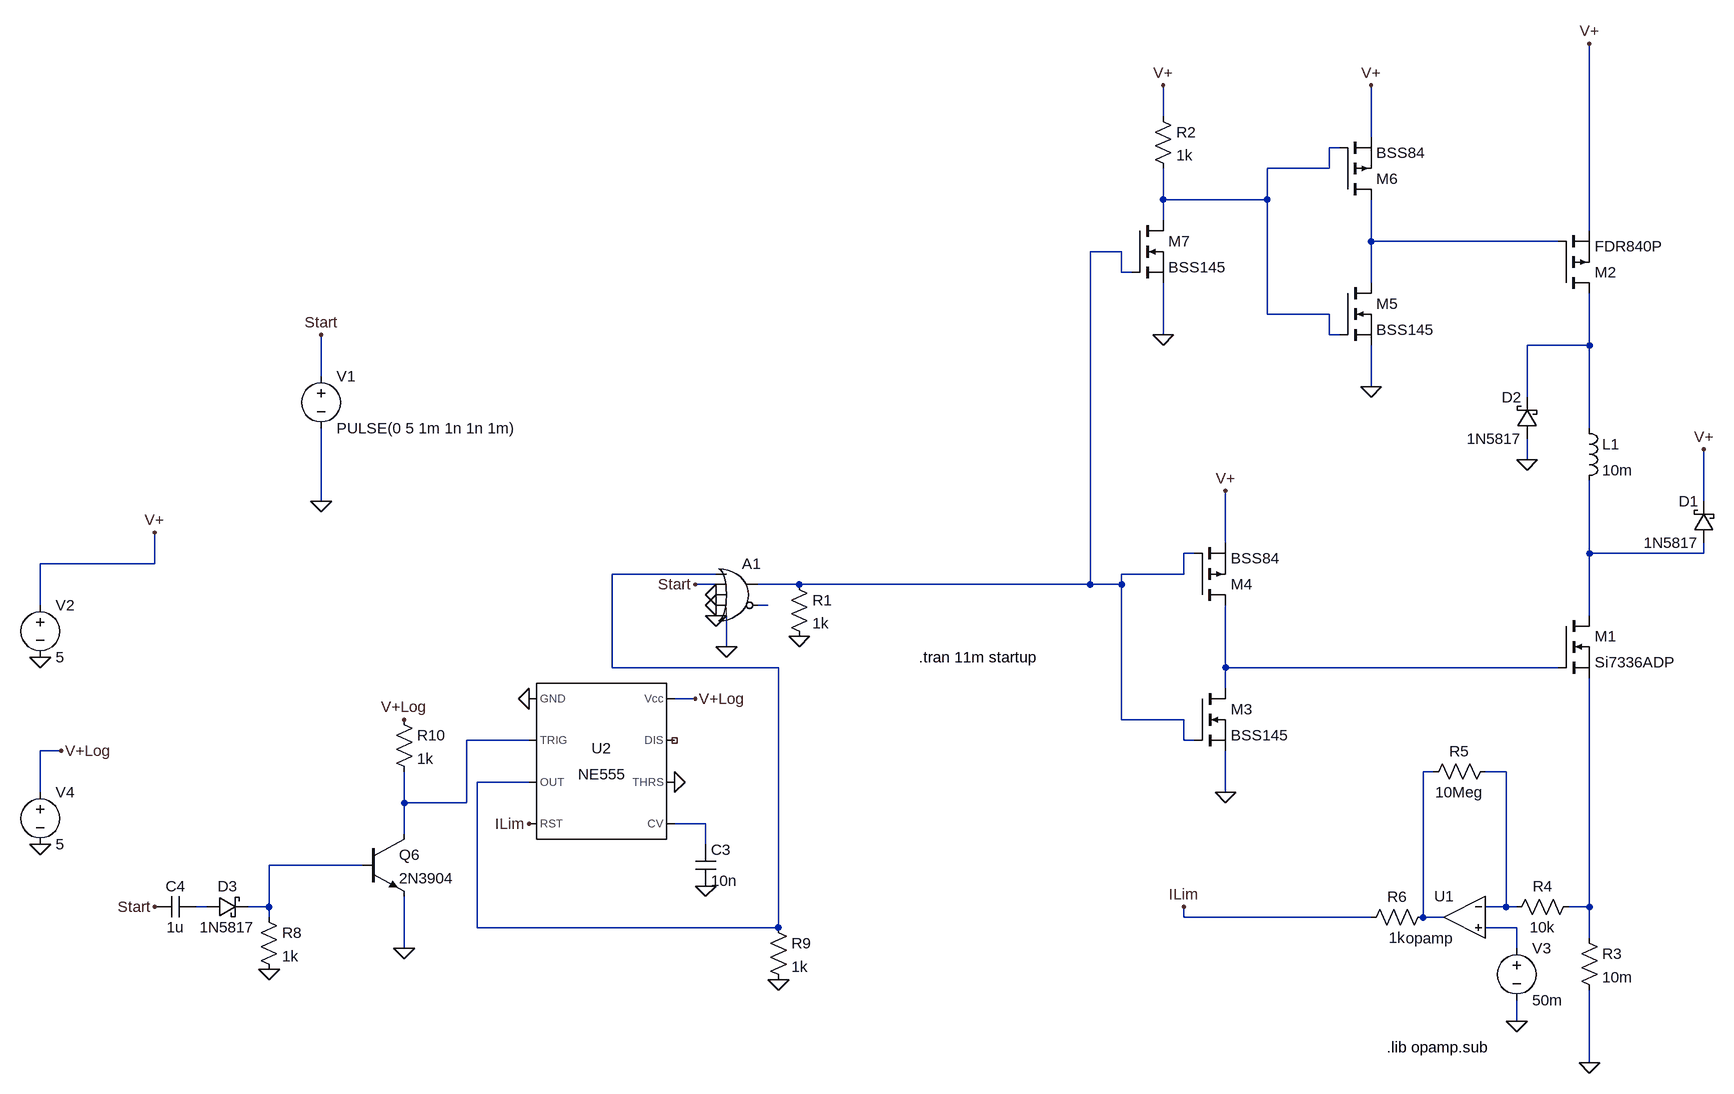
[diagram p0: schematic Saturation_Tester.asc]
Saturation_Tester.asc, the LTspice schematic file:
Version 4
SHEET 1 1768 1012
WIRE 752 -608 752 -656
WIRE 1072 -576 1072 -656
WIRE 1024 -560 1008 -560
WIRE 1008 -528 1008 -560
WIRE 1008 -528 912 -528
WIRE 752 -480 752 -528
WIRE 912 -480 912 -528
WIRE 912 -480 752 -480
WIRE 752 -448 752 -480
WIRE 1408 -432 1408 -720
WIRE 1072 -416 1072 -480
WIRE 1360 -416 1072 -416
WIRE 688 -400 640 -400
WIRE 688 -368 688 -400
WIRE 704 -368 688 -368
WIRE 1072 -352 1072 -416
WIRE 912 -304 912 -480
WIRE 1008 -304 912 -304
WIRE 752 -272 752 -352
WIRE 1008 -272 1008 -304
WIRE 1024 -272 1008 -272
WIRE 1408 -256 1408 -336
WIRE 1408 -256 1312 -256
WIRE -544 -208 -544 -272
WIRE 1072 -192 1072 -256
WIRE 1312 -176 1312 -256
WIRE 1408 -128 1408 -256
WIRE 1312 -80 1312 -112
WIRE -544 -16 -544 -128
WIRE 1584 -16 1584 -96
WIRE 848 48 848 -32
WIRE 800 64 784 64
WIRE 1408 64 1408 -48
WIRE 1584 64 1584 48
WIRE 1584 64 1408 64
WIRE -800 80 -800 32
WIRE -800 80 -976 80
WIRE 64 96 -96 96
WIRE 784 96 784 64
WIRE 784 96 688 96
WIRE 64 112 32 112
WIRE 192 112 128 112
WIRE 640 112 640 -400
WIRE 640 112 192 112
WIRE 688 112 688 96
WIRE 688 112 640 112
WIRE -976 144 -976 80
WIRE 144 144 128 144
WIRE 1408 160 1408 64
WIRE 80 208 80 160
WIRE -96 240 -96 96
WIRE 160 240 -96 240
WIRE 848 240 848 144
WIRE 1360 240 848 240
WIRE 848 272 848 240
WIRE 32 288 0 288
WIRE 688 320 688 112
WIRE 784 320 688 320
WIRE -224 352 -320 352
WIRE 784 352 784 320
WIRE 800 352 784 352
WIRE -944 368 -976 368
WIRE 1168 400 1152 400
WIRE 1280 400 1248 400
WIRE -224 416 -304 416
WIRE -976 432 -976 368
WIRE 848 432 848 368
WIRE -416 448 -416 400
WIRE -320 448 -320 352
WIRE -320 448 -416 448
WIRE 48 480 0 480
WIRE -416 496 -416 448
WIRE 48 512 48 480
WIRE -480 544 -624 544
WIRE -720 608 -736 608
WIRE -624 608 -624 544
WIRE -624 608 -656 608
WIRE 1280 608 1280 400
WIRE 1280 608 1248 608
WIRE 1296 608 1280 608
WIRE 1408 608 1408 256
WIRE 1408 608 1376 608
WIRE -624 624 -624 608
WIRE 784 624 784 608
WIRE 1072 624 784 624
WIRE 1152 624 1152 400
WIRE 1184 624 1152 624
WIRE -304 640 -304 416
WIRE 160 640 160 240
WIRE 160 640 -304 640
WIRE 1296 640 1248 640
WIRE 1408 656 1408 608
WIRE -416 672 -416 592
WIRE 1296 672 1296 640
WIRE 1296 784 1296 752
WIRE 1408 848 1408 736
FLAG 80 208 0
FLAG 192 192 0
FLAG -544 -16 0
FLAG -976 224 0
FLAG -800 32 V+
FLAG 848 -32 V+
FLAG 848 432 0
FLAG 1408 848 0
FLAG 1408 -720 V+
FLAG 752 -272 0
FLAG 752 -656 V+
FLAG 1072 -656 V+
FLAG 1072 -192 0
FLAG 1296 784 0
FLAG 784 608 ILim
FLAG 1312 -80 0
FLAG 1584 -96 V+
FLAG -544 -272 Start
FLAG 48 576 0
FLAG -224 288 0
FLAG -224 480 ILim
FLAG -800 608 Start
FLAG -624 704 0
FLAG 32 112 Start
FLAG 64 160 0
FLAG 64 144 0
FLAG 64 128 0
FLAG 160 720 0
FLAG -976 512 0
FLAG -944 368 V+Log
FLAG 32 288 V+Log
FLAG 0 416 0
FLAG -416 320 V+Log
FLAG -416 672 0
SYMBOL res 176 96 R0
SYMATTR InstName R1
SYMATTR Value 1k
SYMBOL voltage -544 -224 R0
WINDOW 123 0 0 Left 0
WINDOW 39 0 0 Left 0
SYMATTR InstName V1
SYMATTR Value PULSE(0 5 1m 1n 1n 1m)
SYMBOL voltage -976 128 R0
WINDOW 123 0 0 Left 0
WINDOW 39 0 0 Left 0
SYMATTR InstName V2
SYMATTR Value 5
SYMBOL nmos 1360 160 R0
SYMATTR InstName M1
SYMATTR Value Si7336ADP
SYMBOL ind 1392 -144 R0
SYMATTR InstName L1
SYMATTR Value 10m
SYMATTR SpiceLine2 flux=10m*5*tanh(x*(1/5))
SYMATTR SpiceLine Ipk=10 Rser=0.0226
SYMBOL res 736 -624 R0
SYMATTR InstName R2
SYMATTR Value 1k
SYMBOL pmos 1360 -336 M180
SYMATTR InstName M2
SYMATTR Value FDR840P
SYMBOL OpAmps\\opamp 1216 560 M0
SYMATTR InstName U1
SYMBOL res 1392 640 R0
SYMATTR InstName R3
SYMATTR Value 10m
SYMBOL voltage 1296 656 R0
WINDOW 123 0 0 Left 0
WINDOW 39 0 0 Left 0
SYMATTR InstName V3
SYMATTR Value 50m
SYMBOL res 1392 592 R90
WINDOW 0 0 56 VBottom 2
WINDOW 3 32 56 VTop 2
SYMATTR InstName R4
SYMATTR Value 10k
SYMBOL res 1264 384 R90
WINDOW 0 0 56 VBottom 2
WINDOW 3 32 56 VTop 2
SYMATTR InstName R5
SYMATTR Value 10Meg
SYMBOL res 1168 608 R90
WINDOW 0 0 56 VBottom 2
WINDOW 3 32 56 VTop 2
SYMATTR InstName R6
SYMATTR Value 1k
SYMBOL schottky 1600 48 R180
WINDOW 0 24 64 Left 2
WINDOW 3 24 0 Left 2
SYMATTR InstName D1
SYMATTR Value 1N5817
SYMATTR Description Diode
SYMATTR Type diode
SYMBOL schottky 1328 -112 R180
WINDOW 0 24 64 Left 2
WINDOW 3 24 0 Left 2
SYMATTR InstName D2
SYMATTR Value 1N5817
SYMATTR Description Diode
SYMATTR Type diode
SYMBOL Misc\\NE555 -112 384 R0
SYMATTR InstName U2
SYMBOL cap 32 512 R0
SYMATTR InstName C3
SYMATTR Value 10n
SYMBOL cap -736 592 R90
WINDOW 0 0 32 VBottom 2
WINDOW 3 32 32 VTop 2
SYMATTR InstName C4
SYMATTR Value 1u
SYMBOL schottky -720 624 R270
WINDOW 0 32 32 VTop 2
WINDOW 3 0 32 VBottom 2
SYMATTR InstName D3
SYMATTR Value 1N5817
SYMATTR Description Diode
SYMATTR Type diode
SYMBOL res -640 608 R0
SYMATTR InstName R8
SYMATTR Value 1k
SYMBOL Digital\\or 96 64 R0
SYMATTR InstName A1
SYMATTR SpiceLine Vhigh = 5
SYMBOL res 144 624 R0
SYMATTR InstName R9
SYMATTR Value 1k
SYMBOL voltage -976 416 R0
WINDOW 123 0 0 Left 0
WINDOW 39 0 0 Left 0
SYMATTR InstName V4
SYMATTR Value 5
SYMBOL npn -480 496 R0
SYMATTR InstName Q6
SYMATTR Value 2N3904
SYMBOL res -432 304 R0
SYMATTR InstName R10
SYMATTR Value 1k
SYMBOL nmos 800 272 R0
SYMATTR InstName M3
SYMATTR Value BSS145
SYMBOL pmos 800 144 M180
SYMATTR InstName M4
SYMATTR Value BSS84
SYMBOL nmos 1024 -352 R0
SYMATTR InstName M5
SYMATTR Value BSS145
SYMBOL pmos 1024 -480 M180
SYMATTR InstName M6
SYMATTR Value BSS84
SYMBOL nmos 704 -448 R0
SYMATTR InstName M7
SYMATTR Value BSS145
TEXT 376 224 Left 2 !.tran 11m startup
TEXT 1096 824 Left 2 !.lib opamp.sub

The netlist it stands for:
* Saturation_Tester.asc
R1 N003 0 1k
V1 Start 0 PULSE(0 5 1m 1n 1n 1m)
V2 V+ 0 5
M1 N005 N008 N015 N015 Si7336ADP
L1 N004 N005 10m Ipk=10 Rser=0.0226 flux=10m*5*tanh(x*(1/5))
R2 V+ N001 1k
M2 N004 N002 V+ V+ FDR840P
XU1 N011 N016 N010 opamp Aol=100K GBW=10Meg  ; pins invin noninvin out
R3 N015 0 10m
V3 N016 0 50m
R4 N015 N011 10k
R5 N011 N010 10Meg
R6 N010 ILim 1k
D1 N005 V+ 1N5817
D2 0 N004 1N5817
XU2 0 N009 N006 ILim N012 0 NC_01 V+Log NE555  ; pins GND TRIG OUT RST CV THRS DIS Vcc
C3 N012 0 10n
C4 N014 Start 1u
D3 N014 N013 1N5817
R8 N013 0 1k
A1 N006 Start 0 0 0 N007 N003 0 OR Vhigh = 5
R9 N006 0 1k
V4 V+Log 0 5
Q6 N009 N013 0 0 2N3904
R10 V+Log N009 1k
M3 N008 N003 0 0 BSS145
M4 N008 N003 V+ V+ BSS84
M5 N002 N001 0 0 BSS145
M6 N002 N001 V+ V+ BSS84
M7 N001 N003 0 0 BSS145
.model D D
.lib standard.dio
.model NPN NPN
.model PNP PNP
.lib standard.bjt
.model NMOS NMOS
.model PMOS PMOS
.lib standard.mos
.tran 11m startup
.lib opamp.sub
.lib NE555.sub
.backanno
.end

* Results of the author's LTspice run, read from the files saved beside the schematic
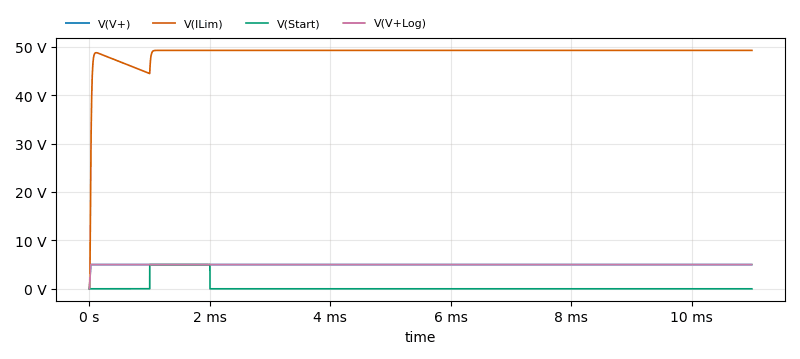
[diagram p1: Transient Analysis of Saturation_Tester.asc, plotted from the saved traces]
* Transient Analysis, 1 run:
*   V(V+): min 0 V, max 5 V, average 4.995 V, rms 4.997 V, last 5 V
*   V(ILim): min 0 V, max 49.24 V, average 48.9 V, rms 48.95 V, last 49.24 V
*   V(Start): min 0 V, max 5 V, average 454.5 mV, rms 1.508 V, last 0 V
*   V(V+Log): min 0 V, max 5 V, average 4.995 V, rms 4.997 V, last 5 V